# EAGLE design small_esc (EAGLE 7.2.0)
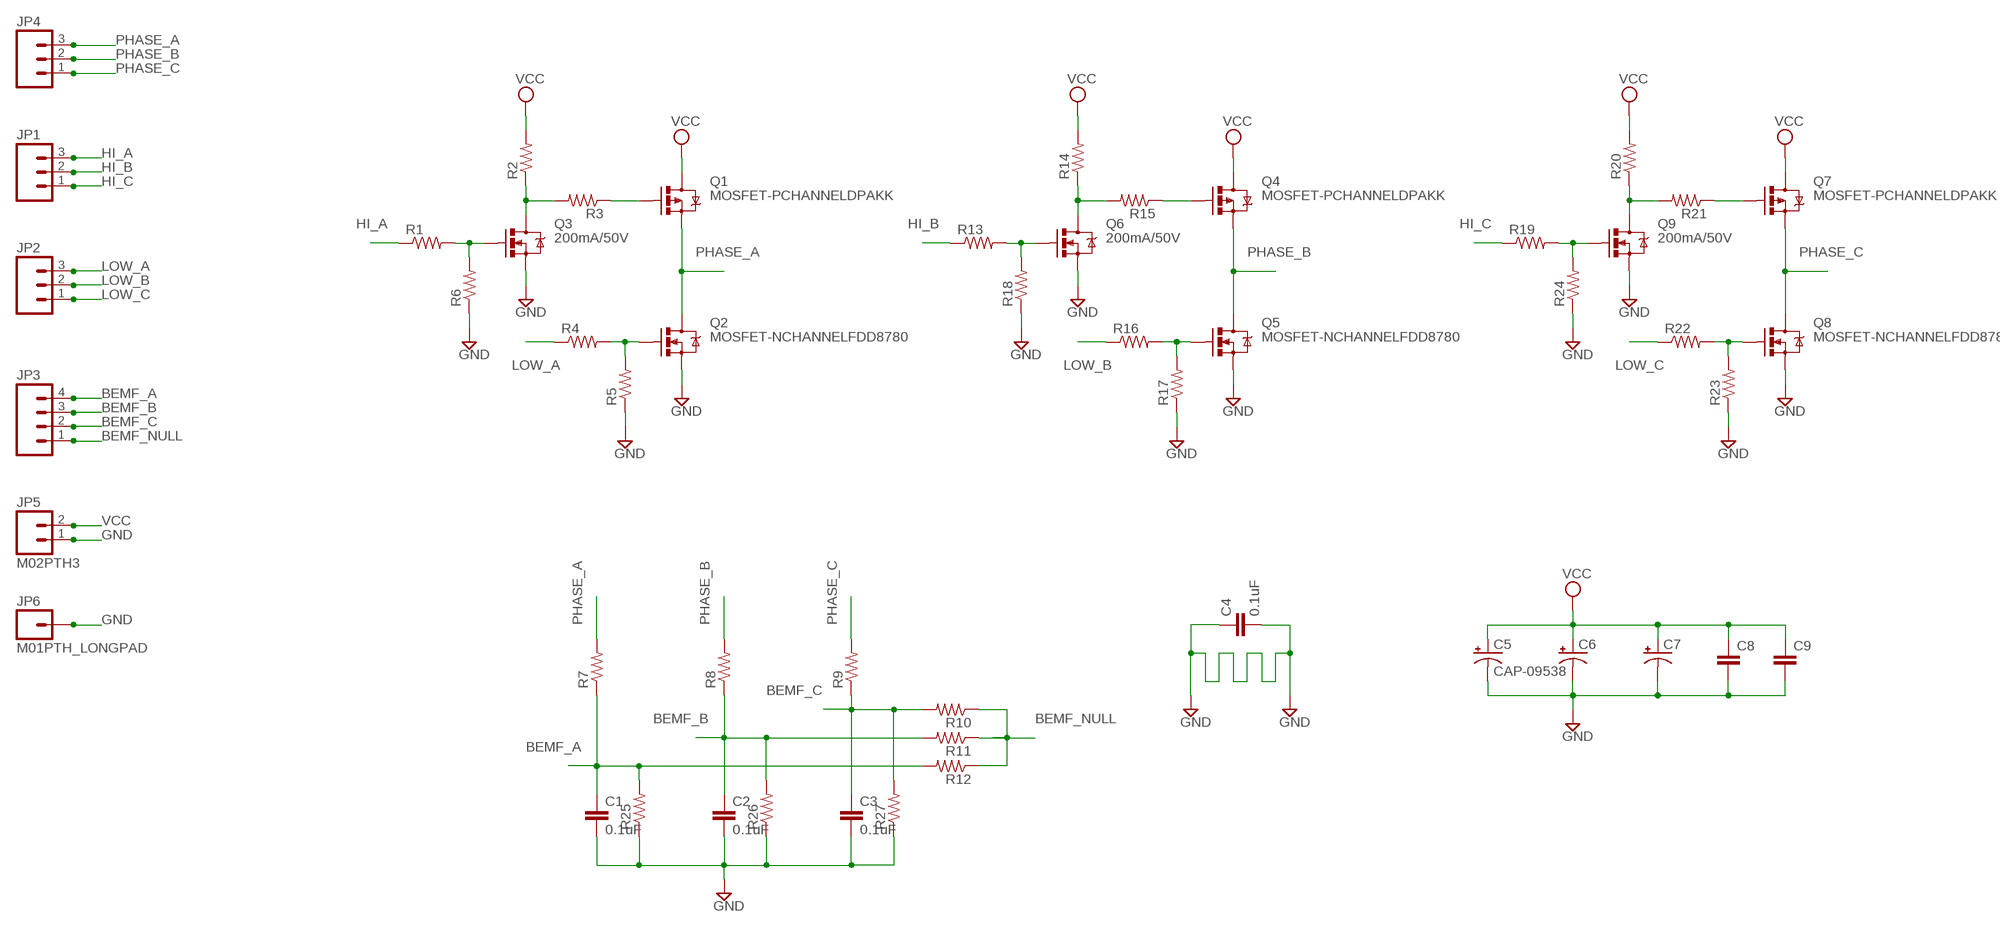
[diagram p0: schematic, sheet 1]

## Parts
C1  0.1uF  0.1UF-25V(+80/-20%)(0603)  [0603-CAP]
C2  0.1uF  0.1UF-25V(+80/-20%)(0603)  [0603-CAP]
C3  0.1uF  0.1UF-25V(+80/-20%)(0603)  [0603-CAP]
C4  0.1uF  0.1UF-25V(+80/-20%)(0603)  [0603-CAP]
C5  CAP-09538  1000UF-25V(PTH)  [CPOL-RADIAL-1000UF-25V]
C6  CAP_POLPTH2  [CPOL-RADIAL-10UF-25V]
C7  CAP_POLPTH2  [CPOL-RADIAL-10UF-25V]
C8  0.1UF-50V-20%(PTH)KIT-EZ  [CAP-PTH-SMALL-KIT]
C9  0.1UF-50V-20%(PTH)KIT-EZ  [CAP-PTH-SMALL-KIT]
JP1  M03LONGPADS  [1X03_LONGPADS]
JP2  M03LONGPADS  [1X03_LONGPADS]
JP3  M04LONGPADS  [1X04_LONGPADS]
JP4  M03LONGPADS  [1X03_LONGPADS]
JP5  M02PTH3  [1X02_LONGPADS]
JP6  M01PTH_LONGPAD  [1X01_LONGPAD]
Q1  MOSFET-PCHANNELDPAKK  [DPAK]
Q2  MOSFET-NCHANNELFDD8780  [DPAK]
Q3  200mA/50V  MOSFET-NCHANNELBSS138  [SOT23-3]
Q4  MOSFET-PCHANNELDPAKK  [DPAK]
Q5  MOSFET-NCHANNELFDD8780  [DPAK]
Q6  200mA/50V  MOSFET-NCHANNELBSS138  [SOT23-3]
Q7  MOSFET-PCHANNELDPAKK  [DPAK]
Q8  MOSFET-NCHANNELFDD8780  [DPAK]
Q9  200mA/50V  MOSFET-NCHANNELBSS138  [SOT23-3]
R1  RESISTOR0603  [0603-RES]
R2  RESISTOR0603  [0603-RES]
R3  RESISTOR0603  [0603-RES]
R4  RESISTOR0603  [0603-RES]
R5  RESISTOR0603  [0603-RES]
R6  RESISTOR0603  [0603-RES]
R7  RESISTOR0603  [0603-RES]
R8  RESISTOR0603  [0603-RES]
R9  RESISTOR0603  [0603-RES]
R10  RESISTOR0603  [0603-RES]
R11  RESISTOR0603  [0603-RES]
R12  RESISTOR0603  [0603-RES]
R13  RESISTOR0603  [0603-RES]
R14  RESISTOR0603  [0603-RES]
R15  RESISTOR0603  [0603-RES]
R16  RESISTOR0603  [0603-RES]
R17  RESISTOR0603  [0603-RES]
R18  RESISTOR0603  [0603-RES]
R19  RESISTOR0603  [0603-RES]
R20  RESISTOR0603  [0603-RES]
R21  RESISTOR0603  [0603-RES]
R22  RESISTOR0603  [0603-RES]
R23  RESISTOR0603  [0603-RES]
R24  RESISTOR0603  [0603-RES]
R25  RESISTOR0603  [0603-RES]
R26  RESISTOR0603  [0603-RES]
R27  RESISTOR0603  [0603-RES]

## Nets
BEMF_A: C1.1 JP3.4 R7.1 R12.2 R25.2
BEMF_B: C2.1 JP3.3 R8.1 R11.2 R26.2
BEMF_C: C3.1 JP3.2 R9.1 R10.2 R27.2
BEMF_NULL: JP3.1 R10.1 R11.1 R12.1
GND: C1.2 C2.2 C3.2 C4.1 C4.2 C5.- C6.2(-) C7.2(-) C8.2 C9.2 JP5.1 JP6.1 Q2.3(S) Q3.2(S) Q5.3(S) Q6.2(S) Q8.3(S) Q9.2(S) R5.1 R6.1 R17.1 R18.1 R23.1 R24.1 R25.1 R26.1 R27.1
HI_A: JP1.3 R1.1
HI_B: JP1.2 R13.1
HI_C: JP1.1 R19.1
LOW_A: JP2.3 R4.1
LOW_B: JP2.2 R16.1
LOW_C: JP2.1 R22.1
N$1: Q1.1(G) R3.1
N$2: Q3.3(D) R2.1 R3.2
N$3: Q3.1(G) R1.2 R6.2
N$5: Q2.1(G) R4.2 R5.2
N$10: Q4.1(G) R15.1
N$11: Q6.3(D) R14.1 R15.2
N$12: Q6.1(G) R13.2 R18.2
N$14: Q5.1(G) R16.2 R17.2
N$17: Q7.1(G) R21.1
N$18: Q9.3(D) R20.1 R21.2
N$19: Q9.1(G) R19.2 R24.2
N$20: Q8.1(G) R22.2 R23.2
PHASE_A: JP4.3 Q1.4(S) Q2.4(D) R7.2
PHASE_B: JP4.2 Q4.4(S) Q5.4(D) R8.2
PHASE_C: JP4.1 Q7.4(S) Q8.4(D) R9.2
VCC: C5.+ C6.1(+) C7.1(+) C8.1 C9.1 JP5.2 Q1.3(D) Q4.3(D) Q7.3(D) R2.2 R14.2 R20.2

## Library data of the parts
C1-C4 = SparkFun-Capacitors:0.1UF-25V(+80/-20%)(0603): CAP-00810 Ceramic Standard decoupling cap; PROD_ID: CAP-00810
C5 = SparkFun-Capacitors:1000UF-25V(PTH): CAP-08070; PROD_ID: CAP-09538
C6 C7 = SparkFun-Capacitors:CAP_POL: Capacitor Polarized These are standard SMD and PTH capacitors. Normally 10uF, 47uF, and 100uF in electrolytic and tantalum varieties. Always verify the external diameter of the through hole cap, it varies with capacity, voltage, and manufacturer. The EIA devices should be standard.
C8 C9 = SparkFun-Capacitors:0.1UF-50V-20%(PTH): CAP-08370; PROD_ID: CAP-08370
JP1 JP2 JP4 = SparkFun-Connectors:M03: Header 3 Standard 3-pin 0.1" header. Use with straight break away headers (SKU : PRT-00116), right angle break away headers (PRT-00553), swiss pins (PRT-00743), machine pins (PRT-00117), and female headers (PRT-00115). Molex polarized connector foot print use with SKU : PRT-08232 with associated crimp pins and housings.
JP3 = SparkFun-Connectors:M04: Header 4 Standard 4-pin 0.1" header. Use with straight break away headers (SKU : PRT-00116), right angle break away headers (PRT-00553), swiss pins (PRT-00743), machine pins (PRT-00117), and female headers (PRT-00115). Molex polarized connector foot print use with SKU : PRT-08231 with associated crimp pins and housings. 1MM SMD Version SKU: PRT-10208
JP5 = SparkFun-Connectors:M02: Standard 2-pin 0.1" header. Use with - straight break away headers ( PRT-00116) - right angle break away headers (PRT-00553) - swiss pins (PRT-00743) - machine pins (PRT-00117) - female headers (PRT-00115) Molex polarized connector foot print use with: PRT-08233 with associated crimp pins and housings. 2.54_SCREWTERM for use with PRT-10571. 3.5mm Screw Terminal footprints for PRT-08084 5mm Screw Terminal footprints for use with PRT-08432
JP6 = SparkFun-Connectors:M01: Header 1 Standard 1-pin 0.1" header. Use with straight break away headers (SKU : PRT-00116), right angle break away headers (PRT-00553), swiss pins (PRT-00743), machine pins (PRT-00117), and female headers (PRT-00115).
Q1 Q4 Q7 = SparkFun-DiscreteSemi:MOSFET-PCHANNEL: Generic PMOSFET IRLML2244 - TRANS-11153 (SOT-23 -20V -4.3A) (1.Gate 2.Source 3.Drain) FQP27P06 - COM-10349 <http://www.sparkfun.com/products/10349> (TO-220 -60V -27A) (1.Gate 2.Source 3.Drain)
Q2 Q5 Q8 = SparkFun-DiscreteSemi:MOSFET-NCHANNEL: Common NMOSFET Parts MFG P/N Store ID Prod ID FDD8780 TRANS-09984 SI7820DN TRANS-11055 FDS6630A IC-08089 2N7002PW TRANS-11151 FQP30N06L COM-10213 TRANS-10060 BSS123LT1G TRANS-08345 BSS138 TRANS-00830 BS170 2N7000; PROD_ID: TRANS-09984
Q3 Q6 Q9 = SparkFun-DiscreteSemi:MOSFET-NCHANNEL: Common NMOSFET Parts MFG P/N Store ID Prod ID FDD8780 TRANS-09984 SI7820DN TRANS-11055 FDS6630A IC-08089 2N7002PW TRANS-11151 FQP30N06L COM-10213 TRANS-10060 BSS123LT1G TRANS-08345 BSS138 TRANS-00830 BS170 2N7000; PROD_ID: TRANS-00830
R1-R27 = SparkFun-Resistors:RESISTOR: Resistor Basic schematic elements and footprints for 0603, 1206, and PTH resistors.

## Board
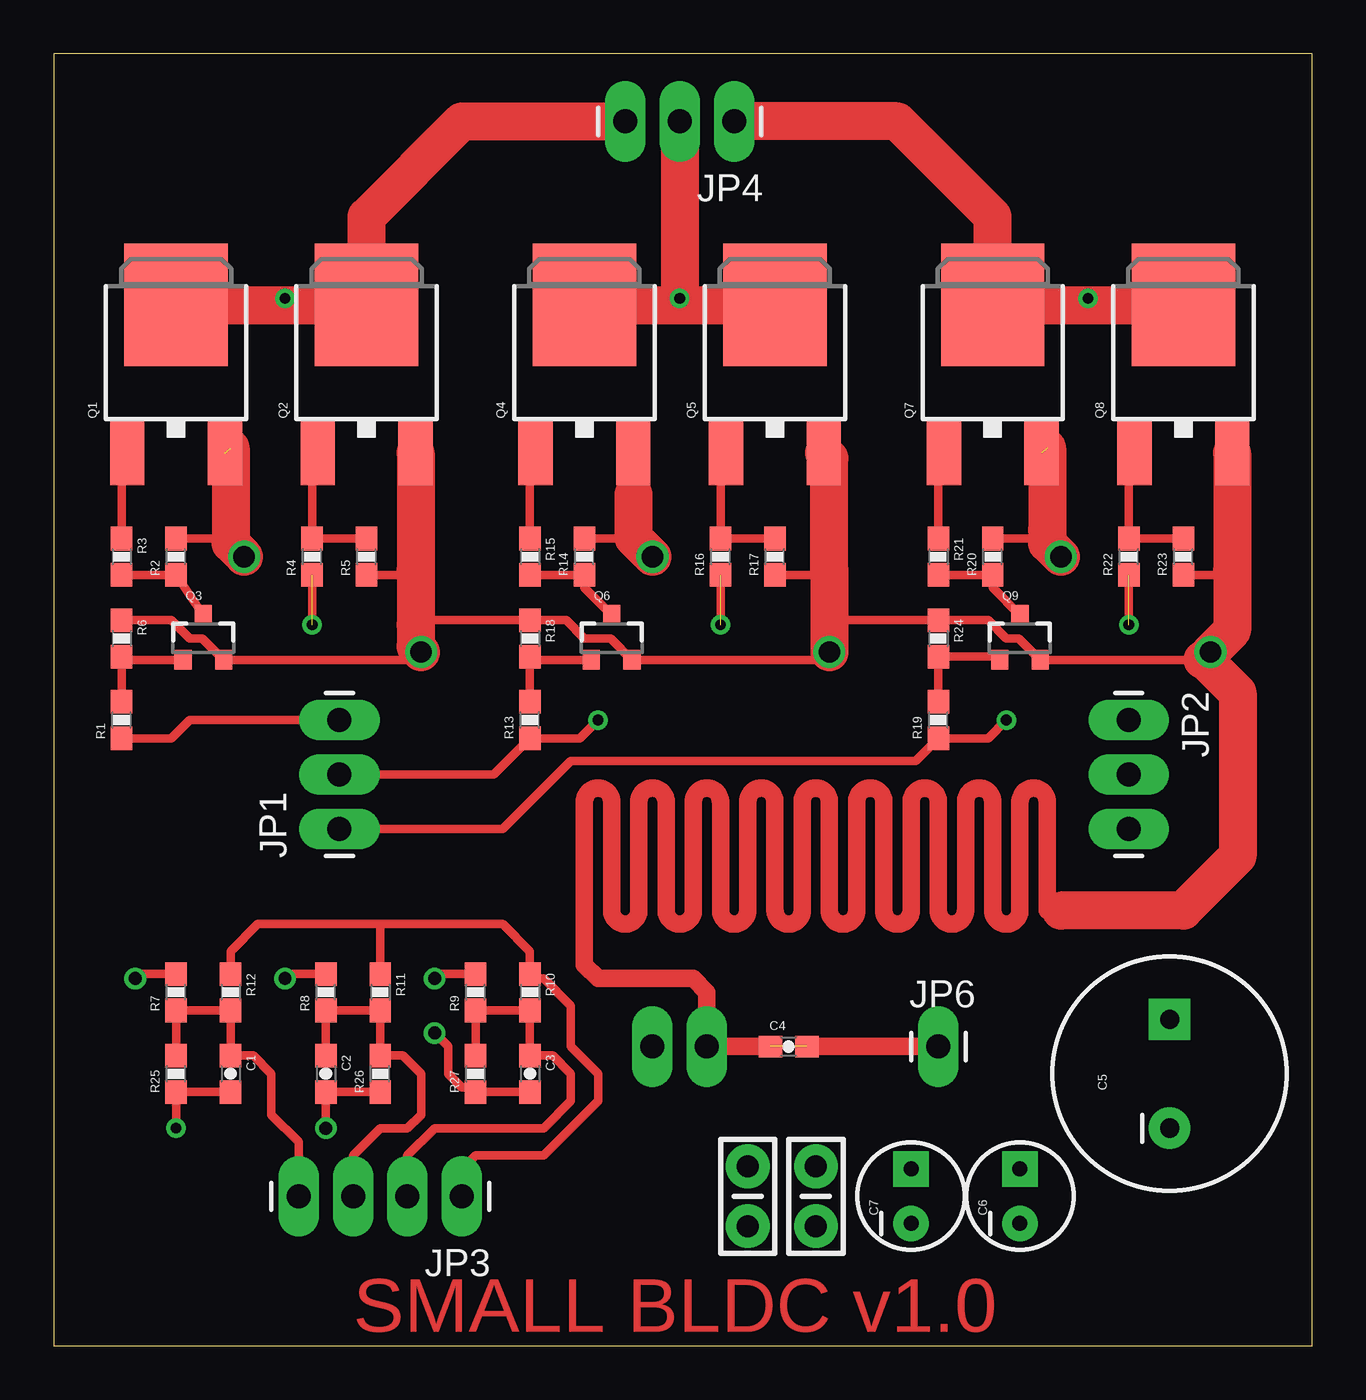
[diagram p1: board, top side]
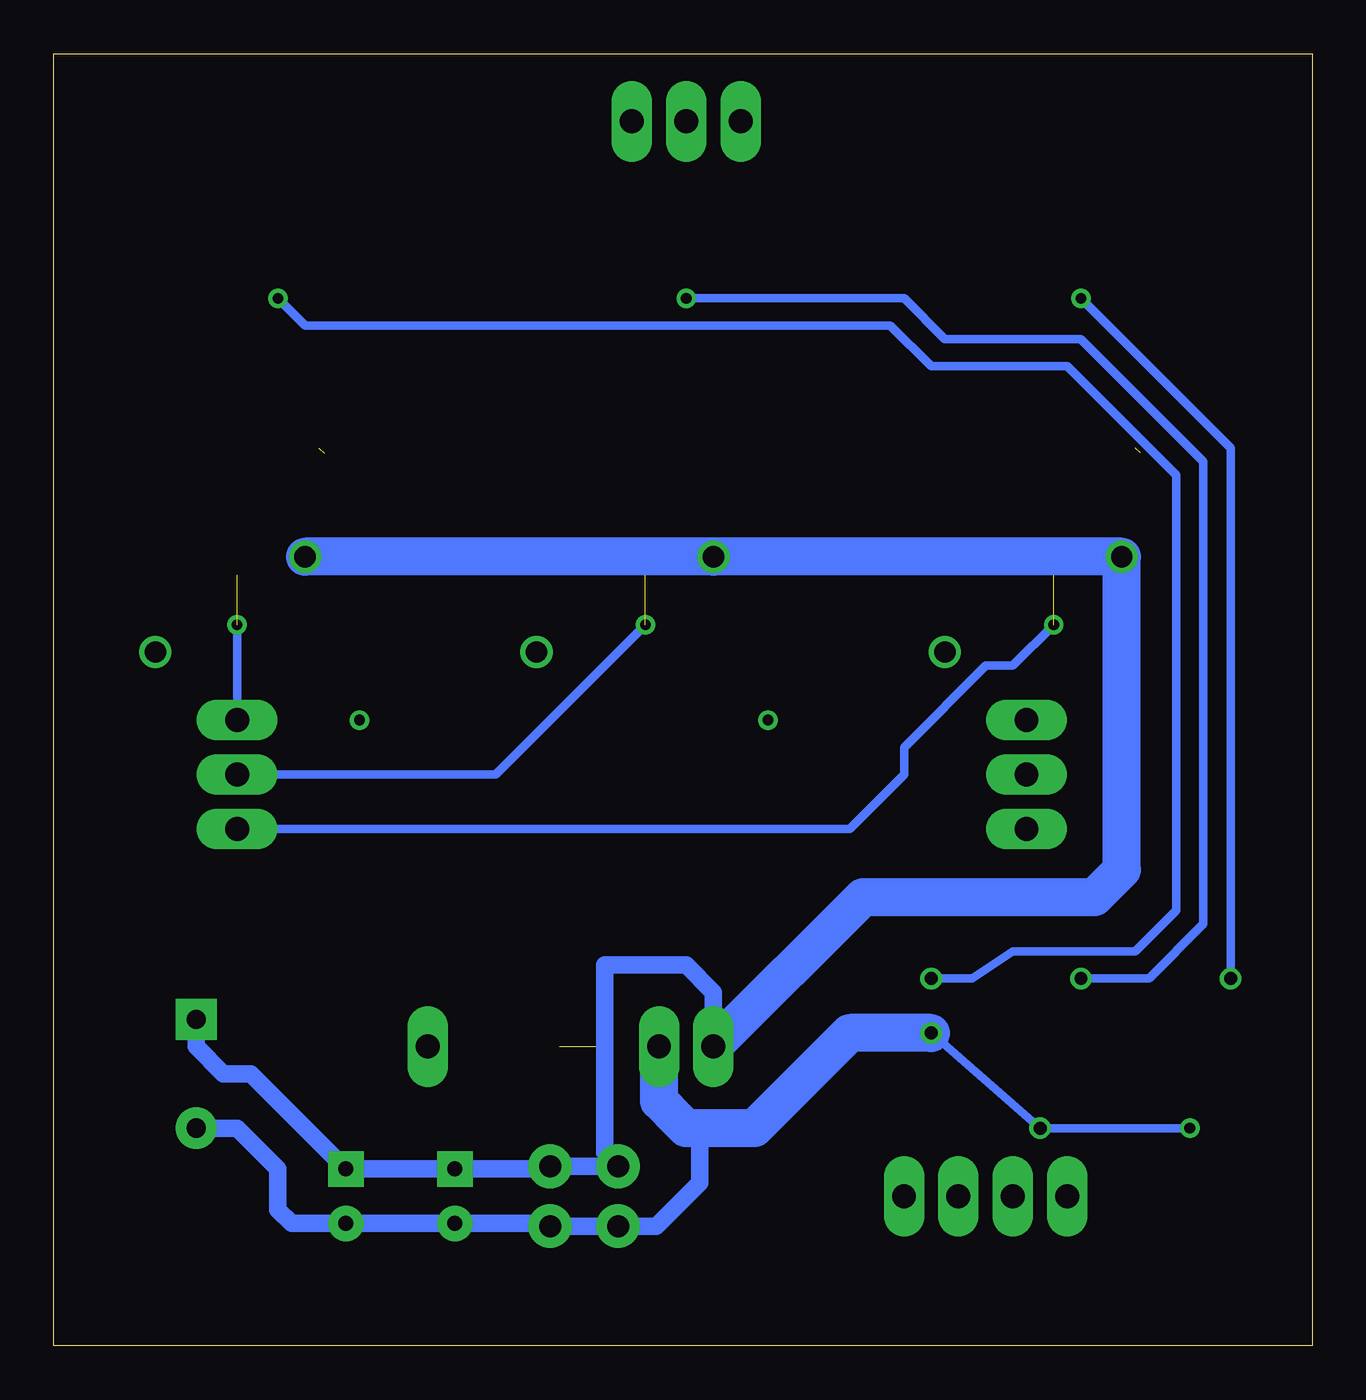
[diagram p2: board, bottom side, seen from below]

Size 58.73 x 60.31 mm. Coordinates in mm from the lower left corner, seen from the top.
Outline: 0,0 58.73,0 58.73,60.31 0,60.31 0,0
Copper layers (1*16): Top 0.035mm / dielectric 1.5mm / Bottom 0.035mm
Design rules "default": minimum track width 10mil, minimum drill 24mil, track to track 8mil, track to pad 8mil, pad to pad 8mil, via to via 8mil, smd to smd 8mil, copper to edge 40mil, drill to drill 8mil, minimum pad ring 10mil, minimum via ring 8mil, stop-mask expansion 4mil, vias tented up to drill 0mil, thermal gap 10mil

### Footprints (pad centres in the part's own frame; a part is rotated, then mirrored left to right if it is on the bottom)
0603-CAP = smd 1.1 x 1: 1 -0.85,0; 2 0.85,0
CPOL-RADIAL-1000UF-25V = drill 0.9 pad 1.93 square: + 2.54,0 | drill 0.9 pad 1.93: - -2.54,0
CPOL-RADIAL-10UF-25V = drill 0.7 pad 1.651 square: 1 1.27,0 | drill 0.7 pad 1.651: 2 -1.27,0
CAP-PTH-SMALL-KIT = drill 1.016 pad 2.032: 1 -1.397,0; 2 1.397,0
1X03_LONGPADS = drill 1.118 pad 1.88 long: 1 0,0; 2 2.54,0; 3 5.08,0
1X04_LONGPADS = drill 1.118 pad 1.88 long: 1 0,0; 2 2.54,0; 3 5.08,0; 4 7.62,0
1X02_LONGPADS = drill 1.118 pad 1.88 long: 1 0,0; 2 2.54,0
1X01_LONGPAD = drill 1.118 pad 1.88 long: 1 0,0
DPAK = smd 1.6 x 3: 1 -2.28,-5.31; 3 2.28,-5.31 | smd 4.826 x 5.715: 4 0,1.588
SOT23-3 = smd 0.8 x 0.9: 1 -0.95,-1; 2 0.95,-1; 3 0,1.1
0603-RES = smd 1.1 x 1: 1 -0.85,0; 2 0.85,0

### Placement (x,y rotation side)
C1  8.26,12.7 270 top
C2  12.7,12.7 270 top
C3  22.23,12.7 270 top
C4  34.29,13.97 0 top
C5  52.07,12.7 90 top
C6  45.09,6.99 90 top
C7  40.01,6.99 90 top
C8  35.56,6.99 270 top
C9  32.38,6.99 270 top
JP1  13.34,24.13 90 top
JP2  50.16,29.21 270 top
JP3  19.05,6.99 180 top
JP4  31.75,57.15 180 top
JP5  30.48,13.97 180 top
JP6  41.27,13.97 0 top
Q1  5.71,46.99 0 top
Q2  14.61,46.99 0 top
Q3  6.99,33.02 0 top
Q4  24.77,46.99 0 top
Q5  33.66,46.99 0 top
Q6  26.04,33.02 0 top
Q7  43.81,46.99 0 top
Q8  52.7,46.99 0 top
Q9  45.09,33.02 0 top
R1  3.17,29.21 90 top
R2  5.71,36.83 90 top
R3  3.17,36.83 270 top
R4  12.06,36.83 90 top
R5  14.61,36.83 90 top
R6  3.17,33.02 270 top
R7  5.71,16.51 90 top
R8  12.7,16.51 90 top
R9  19.68,16.51 90 top
R10  22.23,16.51 270 top
R11  15.24,16.51 270 top
R12  8.26,16.51 270 top
R13  22.23,29.21 90 top
R14  24.77,36.83 90 top
R15  22.23,36.83 270 top
R16  31.11,36.83 90 top
R17  33.66,36.83 90 top
R18  22.23,33.02 270 top
R19  41.27,29.21 90 top
R20  43.81,36.83 90 top
R21  41.27,36.83 270 top
R22  50.16,36.83 90 top
R23  52.7,36.83 90 top
R24  41.27,33.02 270 top
R25  5.71,12.7 90 top
R26  15.24,12.7 90 top
R27  19.68,12.7 90 top

### Tracks (layer width: path | path; a pad name or v marks a point on that pad's centre or on a via)
BEMF_A
  Top 0.406: R25.2 R7.1 R12.2 C1.1 9.31,13.55 10.16,12.7 10.16,10.79 11.43,9.53 JP3.4
BEMF_B
  Top 0.406: C2.1 R8.1 R11.2 R26.2 16.3,13.55 17.14,12.7 17.14,10.79 16.51,10.16 15.24,10.16 13.97,8.89 JP3.3
BEMF_C
  Top 0.406: R27.2 R9.1 R10.2 C3.1 23.28,13.55 24.13,12.7 24.13,11.43 22.86,10.16 17.78,10.16 16.51,8.89 JP3.2
BEMF_NULL
  Top 0.406: JP3.1 19.05,8.26 19.68,8.89 22.86,8.89 25.4,11.43 25.4,12.7 24.13,13.97 24.13,15.88 22.86,17.14 22.44,17.14 R10.1 22.23,18.41 20.95,19.68 15.24,19.68 | R12.1 8.26,18.41 9.53,19.68 15.24,19.68 | R11.1 15.24,19.68
GND  (via drill 0.5, 0.6)  (1 unrouted)
  Top 0.406: R17.1 35.98,35.98 36.2,36.2 | C3.2 R27.1 19.68,12.06 19.05,12.06 18.41,12.7 18.41,13.97 v17.78,14.61 | v12.7,10.16 C2.2 R26.1 | R5.1 16.67,35.98 16.89,36.2 | 17.14,32.38 16.78,32.02 Q3.2 6.93,33.02 6.35,33.02 5.5,33.87 R6.1 | R23.1 54.77,35.98 54.98,36.2 | 36.2,32.38 35.83,32.02 Q6.2 25.98,33.02 24.77,33.02 23.91,33.87 R18.1 17.1,33.87 16.89,33.66 | 53.98,32.38 53.61,32.02 Q9.2 45.03,33.02 44.45,33.02 43.6,33.87 R24.1 36.41,33.87 36.2,33.66 | v5.71,10.16 R25.1 C1.2 | 46.99,20.32 46.35,20.32
  Top 0.813: 46.35,20.32 46.35,25.4 arc180 45.09,25.4 45.09,20.32 arc-180 43.81,20.32 43.81,25.4 arc180 42.55,25.4 42.55,20.32 arc-180 41.27,20.32 41.27,25.4 arc180 40.01,25.4 40.01,20.32 arc-180 38.73,20.32 38.73,25.4 arc180 37.47,25.4 37.47,20.32 arc-180 36.2,20.32 36.2,25.4 arc180 34.92,25.4 34.92,20.32 arc-180 33.66,20.32 33.66,25.4 arc180 32.38,25.4 32.38,20.32 arc-180 31.11,20.32 31.11,25.4 arc180 29.84,25.4 29.84,20.32 arc-180 28.57,20.32 28.57,25.4 arc180 27.3,25.4 27.3,20.32 arc-180 26.04,20.32 26.04,25.4 arc180 24.77,25.4 24.77,17.78 25.4,17.14 29.84,17.14 30.48,16.51 JP5.1 C4.1 | JP6.1 C4.2
  Top 1.778: Q5.3 36.2,41.42 36.2,36.2 36.2,33.66 36.2,32.38 | Q2.3 16.89,36.2 16.89,33.66 16.89,32.65 17.14,32.38 | Q8.3 54.98,36.2 54.98,33.4 53.98,32.38 | 53.61,32.02 53.7,32.02 55.24,30.48 55.24,22.86 52.7,20.32 46.99,20.32
  Bottom 0.406: v17.78,14.61 v12.7,10.16 v5.71,10.16 | 40.01,5.59 C7.2 | 27.3,9.53 28.57,9.53 29.53,10.48
  Bottom 0.813: C5.- 50.16,10.16 48.26,8.26 48.26,6.35 47.62,5.71 C6.2 C7.2 35.69,5.71 C8.2 C9.2 30.61,5.59 28.57,7.62 28.57,9.53
  Bottom 1.778: v17.78,14.61 21.59,14.61 26.04,10.16 29.21,10.16 29.53,10.48 30.48,11.43 JP5.1
HI_A
  Top 0.406: R1.1 5.5,28.36 6.35,29.21 JP1.3
HI_B
  Top 0.406: 25.4,29.21 24.55,28.36 R13.1 20.54,26.67 JP1.2
HI_C
  Top 0.406: 44.45,29.21 43.6,28.36 R19.1 40.22,27.3 24.13,27.3 20.95,24.13 JP1.1
LOW_A  (1 unrouted)
  Bottom 0.406: JP2.3 21.59,24.13 19.05,26.67 19.05,27.94 15.24,31.75 13.97,31.75 12.06,33.66
LOW_B  (1 unrouted)
  Bottom 0.406: JP2.2 38.1,26.67 31.11,33.66
LOW_C  (1 unrouted)
  Bottom 0.406: JP2.1 50.16,33.66
N$1
  Top 0.406: R3.1 3.17,41.42 Q1.1
N$2
  Top 0.406: R3.2 R2.1 Q3.3
N$3
  Top 0.406: R1.2 R6.2 3.33,32.02 Q3.1
N$5
  Top 0.406: R5.2 R4.2 12.06,41.42 Q2.1
N$8  (via drill 0.5)
  other vias: 5.71,10.16
N$10
  Top 0.406: R15.1 22.23,41.42 Q4.1
N$11
  Top 0.406: Q6.3 24.77,35.39 R14.1 R15.2
N$12
  Top 0.406: Q6.1 22.38,32.02 R18.2 R13.2
N$13  (via drill 1)
  other vias: 36.2,32.38
N$14
  Top 0.406: Q5.1 31.11,41.42 R16.2 R17.2
N$15  (via drill 1)
  other vias: 17.14,32.38
N$16  (via drill 1)
  other vias: 53.98,32.38
N$17
  Top 0.406: R21.1 41.27,41.42 Q7.1
N$18
  Top 0.406: R20.1 R21.2 | R20.1 43.81,36.2 | R20.1 43.81,35.39 Q9.3
N$19
  Top 0.406: R19.2 R24.2 43.98,32.17 Q9.1
N$20
  Top 0.406: R23.2 R22.2 50.16,41.42 Q8.1
N$21  (via drill 0.5)
  Top 0.406: v12.06,33.66 12.06,36.2
N$22  (via drill 0.5)
  Top 0.406: v31.11,33.66 31.11,36.2
N$23  (via drill 0.5)
  Top 0.406: 50.16,36.2 v50.16,33.66
N$25  (via drill 0.5)
  other vias: 25.4,29.21
N$26  (via drill 0.5)
  other vias: 44.45,29.21
PHASE_A  (via drill 0.5, 0.6)
  Top 0.406: R7.2 4.03,17.36 v3.81,17.14
  Top 0.813: Q2.4 11.11,48.58 v10.79,48.9
  Top 1.778: Q1.4 Q2.4 14.61,52.7 19.05,57.15 JP4.3
  Bottom 0.406: v3.81,17.14 3.81,41.91 v10.79,48.9
PHASE_B  (via drill 0.5, 0.6)
  Top 0.406: R8.2 11.01,17.36 v10.79,17.14
  Top 1.778: Q4.4 29.21,48.58 | 29.21,48.58 Q5.4 | JP4.2 v29.21,48.9 29.21,48.58
  Bottom 0.406: v10.79,17.14 7.62,17.14 5.08,19.68 5.08,41.27 10.79,46.99 17.14,46.99 19.05,48.9 v29.21,48.9
PHASE_C  (via drill 0.5, 0.6)
  Top 0.406: R9.2 18,17.36 v17.78,17.14 | Q7.4 44.13,48.58 44.45,48.26
  Top 0.813: 44.45,48.26 47.62,48.26 v48.26,48.9
  Top 1.778: Q8.4 Q7.4 43.81,52.7 39.37,57.15 JP4.1
  Bottom 0.406: v17.78,17.14 15.88,17.14 13.97,18.41 8.26,18.41 6.35,20.32 6.35,40.64 11.43,45.72 17.78,45.72 19.68,47.62 46.99,47.62 v48.26,48.9
VCC  (via drill 1)  (2 unrouted)
  Top 0.406: 24.98,37.68 R14.2 26.62,37.68 27.05,38.1 | Q4.3 27.05,39.74 | R2.2 8.04,37.68 8.26,37.47 | R20.2 45.94,37.68 46.35,38.1
  Top 1.778: 27.05,39.74 27.05,38.1 27.05,37.73 v27.94,36.83 | 46.35,41.91 46.35,38.1 46.35,37.47 v46.99,36.83 | 8.26,41.91 8.26,37.47 v8.89,36.83
  Bottom 0.813: JP5.2 27.94,16.51 29.21,17.78 33.02,17.78 33.02,9.02 C9.1 C8.1 35.69,8.26 C7.1 C6.1 49.53,12.7 50.8,12.7 52.07,13.97 C5.+
  Bottom 1.778: v46.99,36.83 v27.94,36.83 v8.89,36.83 8.89,22.23 10.16,20.95 20.95,20.95 JP5.2

### Text on the board
Top: SMALL BLDC v1.0